# EAGLE design apex-alpha (EAGLE 5.11)
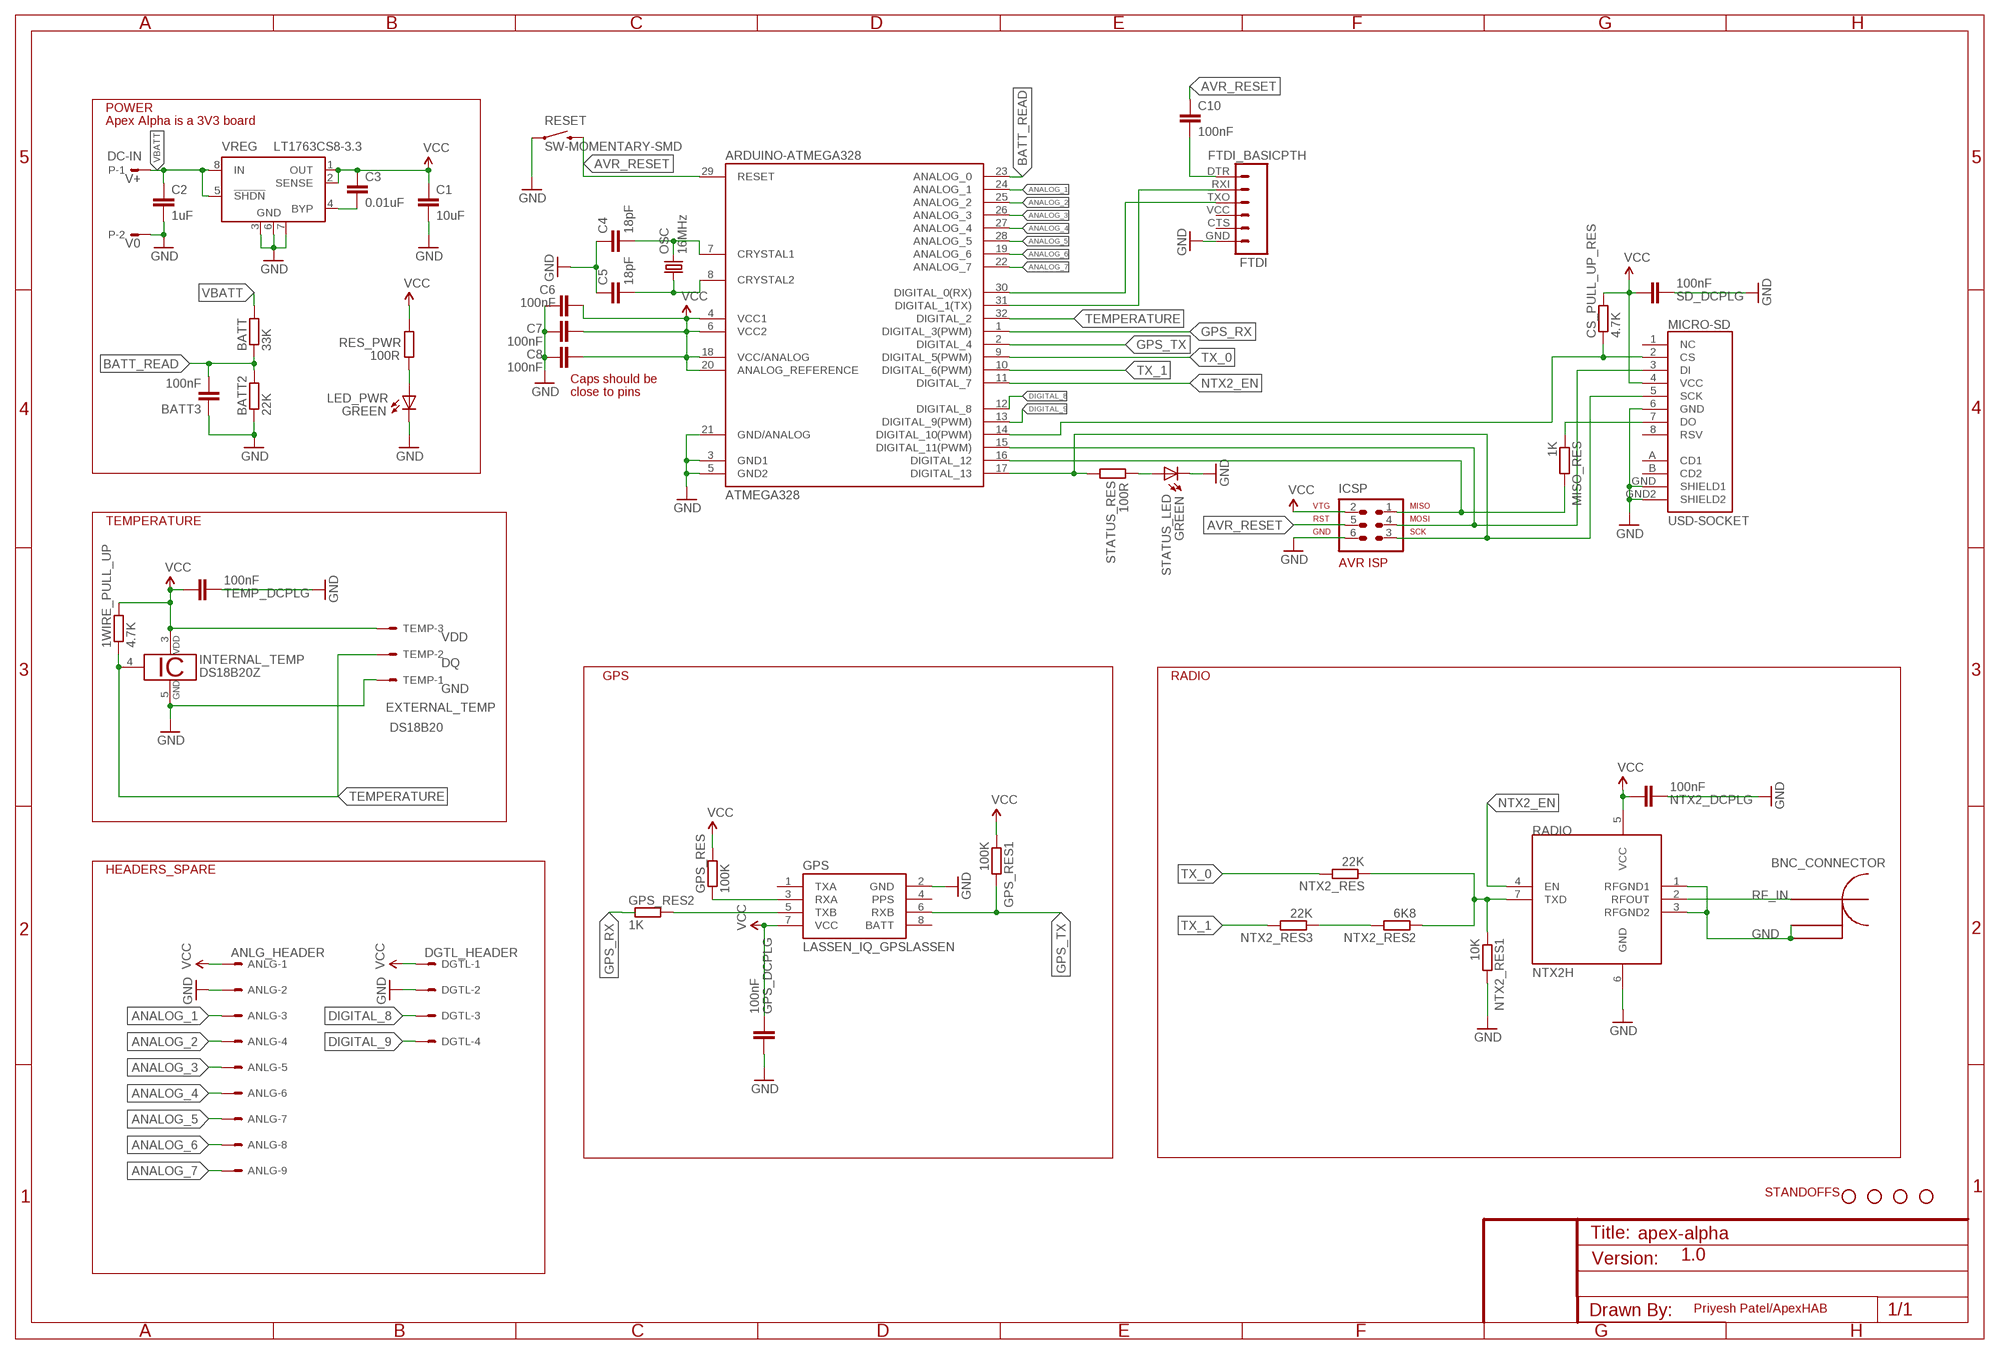
[diagram p0: schematic, sheet 1]

## Parts
1WIRE_PULL_UP  4.7K  R-EU_R0603  [R0603]
ANLG  ANLG_HEADER  22-27-2091-09  [6410-09]
ARDUINO-ATMEGA328  ATMEGA328  ATMEGA168-AU  [TQFP32-08]
BATT  33K  R-EU_R0603  [R0603]
BATT2  22K  R-EU_R0603  [R0603]
BATT3  100nF  CAP0805  [0805]
C1  10uF  CAP0805  [0805]
C2  1uF  CAP0805  [0805]
C3  0.01uF  CAP0805  [0805]
C4  18pF  CAP0805  [0805]
C5  18pF  CAP0805  [0805]
C6  100nF  CAP0805  [0805]
C7  100nF  CAP0805  [0805]
C8  100nF  CAP0805  [0805]
C10  100nF  CAP0805  [0805]
CS_PULL_UP_RES  4.7K  R-EU_R0603  [R0603]
DGTL  DGTL_HEADER  22-27-2041-04  [6410-04]
FTDI  FTDI_BASICPTH  [FTDI_BASIC]
GPS  LASSEN_IQ_GPSLASSEN  [LASSEN_IQ_GPS]
GPS_DCPLG  100nF  CAP0805  [0805]
GPS_RES  100K  R-EU_R0603  [R0603]
GPS_RES1  100K  R-EU_R0603  [R0603]
GPS_RES2  1K  R-EU_R0603  [R0603]
ICSP  AVR-ISP-6  [AVR-ISP-6]
INTERNAL_TEMP  DS18B20Z  [SO08]
JP1  STAND-OFF  [STAND-OFF]
JP2  STAND-OFF  [STAND-OFF]
JP3  STAND-OFF  [STAND-OFF]
JP4  STAND-OFF  [STAND-OFF]
LED_PWR  GREEN  LEDCHIPLED_0603  [CHIPLED_0603]
MICRO-SD  USD-SOCKET  [MICRO-SD-PUSH-PULL]
MISO_RES  1K  R-EU_R0603  [R0603]
NTX2_DCPLG  100nF  CAP0805  [0805]
NTX2_RES  22K  R-EU_R0603  [R0603]
NTX2_RES1  10K  R-EU_R0603  [R0603]
NTX2_RES2  6K8  R-EU_R0603  [R0603]
NTX2_RES3  22K  R-EU_R0603  [R0603]
OSC  16MHz  CRYSTAL5X3  [CRYSTAL-SMD-5X3]
P  DC-IN  22-27-2021-02  [6410-02]
RADIO  NTX2H  [NTX2H]
RES_PWR  100R  R-EU_R0603  [R0603]
RESET  SW-MOMENTARY-SMD  SWITCH-MOMENTARY-2-SMD-1101NE  [TACTILE-SWITCH-1101NE]
SD_DCPLG  100nF  CAP0805  [0805]
STATUS_LED  GREEN  LEDCHIPLED_0603  [CHIPLED_0603]
STATUS_RES  100R  R-EU_R0603  [R0603]
TEMP  EXTERNAL_TEMP  22-27-2031-03  [6410-03]
TEMP_DCPLG  100nF  CAP0805  [0805]
U$1  BNC_BULK  [BNC_BULK]
VREG  LT1763CS8-3.3  [SOIC8]

## Nets
ANALOG_1: ANLG.3 ARDUINO-ATMEGA328.24(ANALOG_1)
ANALOG_2: ANLG.4 ARDUINO-ATMEGA328.25(ANALOG_2)
ANALOG_3: ANLG.5 ARDUINO-ATMEGA328.26(ANALOG_3)
ANALOG_4: ANLG.6 ARDUINO-ATMEGA328.27(ANALOG_4)
ANALOG_5: ANLG.7 ARDUINO-ATMEGA328.28(ANALOG_5)
ANALOG_6: ANLG.8 ARDUINO-ATMEGA328.19(ANALOG_6)
ANALOG_7: ANLG.9 ARDUINO-ATMEGA328.22(ANALOG_7)
AVR_RESET: ARDUINO-ATMEGA328.29(RESET) C10.1 ICSP.5 RESET.P$2
BATT_READ: ARDUINO-ATMEGA328.23(ANALOG_0) BATT2.2 BATT3.2 BATT.1
DIGITAL_8: ARDUINO-ATMEGA328.12(DIGITAL_8) DGTL.3
DIGITAL_9: ARDUINO-ATMEGA328.13(DIGITAL_9(PWM)) DGTL.4
GND: ANLG.2 ARDUINO-ATMEGA328.3(GND1) ARDUINO-ATMEGA328.5(GND2) ARDUINO-ATMEGA328.21(GND/ANALOG) BATT2.1 BATT3.1 C1.2 C2.2 C4.1 C5.1 C6.1 C7.1 C8.1 DGTL.2 FTDI.GND GPS.2(GND) GPS_DCPLG.2 ICSP.6 INTERNAL_TEMP.5 LED_PWR.C MICRO-SD.6(GND) MICRO-SD.GND2(SHIELD2) MICRO-SD.GND(SHIELD1) NTX2_DCPLG.1 NTX2_RES1.2 P.2 RADIO.1(RFGND1) RADIO.3(RFGND2) RADIO.6(GND) RESET.P$1 SD_DCPLG.1 STATUS_LED.C TEMP.1 TEMP_DCPLG.1 U$1.G1(GND1) U$1.G2(GND) VREG.3(GND) VREG.6(GND) VREG.7(GND)
GPS_RX: ARDUINO-ATMEGA328.1(DIGITAL_3(PWM)) GPS_RES2.1
GPS_TX: ARDUINO-ATMEGA328.2(DIGITAL_4) GPS.6(RXB) GPS_RES1.2
MISO: ARDUINO-ATMEGA328.16(DIGITAL_12) ICSP.1 MISO_RES.2
MOSI: ARDUINO-ATMEGA328.15(DIGITAL_11(PWM)) ICSP.4 MICRO-SD.3(DI)
N$1: C3.2 VREG.4(BYP)
N$2: MICRO-SD.7(DO) MISO_RES.1
N$3: LED_PWR.A RES_PWR.1
N$4: C10.2 FTDI.DTR
N$5: ARDUINO-ATMEGA328.8(CRYSTAL2) C5.2 OSC.1
N$6: ARDUINO-ATMEGA328.7(CRYSTAL1) C4.2 OSC.3
N$7: NTX2_RES2.2 NTX2_RES3.1
N$8: STATUS_LED.A STATUS_RES.1
N$9: ARDUINO-ATMEGA328.31(DIGITAL_1(TX)) FTDI.RXI
N$10: ARDUINO-ATMEGA328.30(DIGITAL_0(RX)) FTDI.TXO
N$11: ARDUINO-ATMEGA328.14(DIGITAL_10(PWM)) CS_PULL_UP_RES.1 MICRO-SD.2(CS)
N$12: NTX2_RES1.1 NTX2_RES2.1 NTX2_RES.1 RADIO.7(TXD)
N$13: GPS.3(RXA) GPS_RES.1
N$14: GPS.5(TXB) GPS_RES2.2
NTX2_EN: ARDUINO-ATMEGA328.11(DIGITAL_7) RADIO.4(EN)
RF_IN: RADIO.2(RFOUT) U$1.RF
SCK: ARDUINO-ATMEGA328.17(DIGITAL_13) ICSP.3 MICRO-SD.5(SCK) STATUS_RES.2
TEMPERATURE: 1WIRE_PULL_UP.1 ARDUINO-ATMEGA328.32(DIGITAL_2) INTERNAL_TEMP.4 TEMP.2
TX_0: ARDUINO-ATMEGA328.9(DIGITAL_5(PWM)) NTX2_RES.2
TX_1: ARDUINO-ATMEGA328.10(DIGITAL_6(PWM)) NTX2_RES3.2
VBATT: BATT.2 C2.1 P.1 VREG.5(!SHDN) VREG.8(IN)
VCC: 1WIRE_PULL_UP.2 ANLG.1 ARDUINO-ATMEGA328.4(VCC1) ARDUINO-ATMEGA328.6(VCC2) ARDUINO-ATMEGA328.18(VCC/ANALOG) ARDUINO-ATMEGA328.20(ANALOG_REFERENCE) C1.1 C3.1 C6.2 C7.2 C8.2 CS_PULL_UP_RES.2 DGTL.1 GPS.7(VCC) GPS_DCPLG.1 GPS_RES1.1 GPS_RES.2 ICSP.2 INTERNAL_TEMP.3 MICRO-SD.4(VCC) NTX2_DCPLG.2 RADIO.5(VCC) RES_PWR.2 SD_DCPLG.2 TEMP.3 TEMP_DCPLG.2 VREG.1(OUT) VREG.2(SENSE)
Unconnected: FTDI.CTS FTDI.VCC GPS.1(TXA) GPS.4(PPS) MICRO-SD.1(NC) MICRO-SD.8(RSV) MICRO-SD.A(CD1) MICRO-SD.B(CD2)

## Notes on the sheet
- POWER
- Apex Alpha is a 3V3 board
- V+
- V0
- Caps should be
- close to pins
- TEMPERATURE
- VDD
- DQ
- GPS | RADIO
- GND
- DS18B20
- BNC_CONNECTOR
- HEADERS_SPARE
- STANDOFFS
- 1.0
- Priyesh Patel/ApexHAB

## Power pins joined to a net without a drawn wire
BATT: GPS.8(BATT)

## Library data of the parts
1WIRE_PULL_UP BATT BATT2 CS_PULL_UP_RES GPS_RES GPS_RES1 GPS_RES2 MISO_RES NTX2_RES NTX2_RES1-NTX2_RES3 RES_PWR STATUS_RES = rcl:R-EU_: RESISTOR, European symbol
ANLG = con-molex:22-?-09: CONNECTOR wire to board 2.54 mm (.1 inch) pitch header; OC_FARNELL: unknown; OC_NEWARK: unknown
ARDUINO-ATMEGA328 = Arduino-AVR:ATMEGA168
BATT3 C1-C8 C10 GPS_DCPLG NTX2_DCPLG SD_DCPLG TEMP_DCPLG = SparkFun:CAP: Capacitor Standard 0603 ceramic capacitor, and 0.1" leaded capacitor.
DGTL = con-molex:22-?-04: CONNECTOR wire to board 2.54 mm (.1 inch) pitch header; OC_FARNELL: unknown; OC_NEWARK: unknown
FTDI = SparkFun:FTDI_BASIC: FTDI Basic: 3.3V and 5V
GPS = SparkFun:LASSEN_IQ_GPS: Lassen iq 12-Channel GPS receiver. Schematic and footprint production proven. Spark Fun Electronics SKU : GPS-00163. Surface mount mating connector : GPS-00170
ICSP = avr-4:AVR-ISP-6: AVR ISP-6 Serial Programming Header
INTERNAL_TEMP = 1wire:DS18B20: Programmable Resolution Digital Thermometer This chip provides a onewire thermosensor with approx. 0.5°C accuracy. A programmable over/undertemperure alarm is available. The precision can be set from 9..12 bits. Notes: Vdd must be applied for accurate measurements at low temperatures, as the parasite power circuit otherwise heats the sensor. If parasite power is used, Vdd has to be connected to GND. The DS1822 is a low-cost thermometer chip, the DS18S20 is similar to the DS18B20, but with 9 Bit precision only. Author: Jan Kandziora <jjj@gmx.de>
JP1-JP4 = SparkFun:STAND-OFF: Stand Off This is the mechanical footprint for a #4 phillips button head screw. Use the keepout ring to avoid running the screw head into surrounding components. SKU : PRT-00447
LED_PWR STATUS_LED = led:LED: LED OSRAM: - CHIPLED LG R971, LG N971, LY N971, LG Q971, LY Q971, LO R971, LY R971 LH N974, LH R974 LS Q976, LO Q976, LY Q976 LO Q996 - Hyper CHIPLED LW Q18S LB Q993, LB Q99A, LB R99A - SideLED LS A670, LO A670, LY A670, LG A670, LP A670 LB A673, LV A673, LT A673, LW A673 LH A674 LY A675 LS A676, LA A676, LO A676, LY A676, LW A676 LS A679, LY A679, LG A679 - Hyper Micro SIDELED® LS Y876, LA Y876, LO Y876, LY Y876 LT Y87S - SmartLED LW L88C, LW L88S LB L89C, LB L89S, LG L890 LS L89K, LO L89K, LY L89K LS L896, LA L896, LO L896, LY L896 - TOPLED LS T670, LO T670, LY T670, LG T670, LP T670 LSG T670, LSP T670, LSY T670, LOP T670, LYG T670 LG T671, LOG T671, LSG T671 LB T673, LV T673, LT T673, LW T673 LH T674 LS T676, LA T676, LO T676, LY T676, LB T676, LH T676, LSB T676, LW T676 LB T67C, LV T67C, LT T67C, LS T67K, LO T67K, LY T67K, LW E67C LS E67B, LA E67B, LO E67B, LY E67B, LB E67C, LV E67C, LT E67C LW T67C LS T679, LY T679, LG T679 LS T770, LO T770, LY T770, LG T770, LP T770 LB T773, LV T773, LT T773, LW T773 LH T774 LS E675, LA E675, LY E675, LS T675 LS T776, LA T776, LO T776, LY T776, LB T776 LHGB T686 LT T68C, LB T68C - Hyper Mini TOPLED® LB M676 - Mini TOPLED Santana® LG M470 LS M47K, LO M47K, LY M47K Source: http://www.osram.convergy.de LUXEON: - LUMILED® LXK2-PW12-R00, LXK2-PW12-S00, LXK2-PW14-U00, LXK2-PW14-V00 LXK2-PM12-R00, LXK2-PM12-S00, LXK2-PM14-U00 LXK2-PE12-Q00, LXK2-PE12-R00, LXK2-PE12-S00, LXK2-PE14-T00, LXK2-PE14-U00 LXK2-PB12-K00, LXK2-PB12-L00, LXK2-PB12-M00, LXK2-PB14-N00, LXK2-PB14-P00, LXK2-PB14-Q00 LXK2-PR12-L00, LXK2-PR12-M00, LXK2-PR14-Q00, LXK2-PR14-R00 LXK2-PD12-Q00, LXK2-PD12-R00, LXK2-PD12-S00 LXK2-PH12-R00, LXK2-PH12-S00 LXK2-PL12-P00, LXK2-PL12-Q00, LXK2-PL12-R00 Source: www.luxeon.com KINGBRIGHT: KA-3528ASYC Source: www.kingbright.com
MICRO-SD = matt_brejza:USD-SOCKET: microSD Socket Push-push type uSD socket. Schematic element and footprint production proven. Spark Fun Electronics SKU : PRT-00127. tDoc lines correctly indicate media card edge positions when inserting (unlocked, locked, depressed).
OSC = SparkFun:CRYSTAL: Crystals Various standard crystals. Proven footprints. Spark Fun Electronics SKU : COM-00534
P = con-molex:22-?-02: CONNECTOR wire to board 2.54 mm (.1 inch) pitch header; OC_FARNELL: unknown; OC_NEWARK: unknown
RADIO = matt_brejza:NTX2
RESET = SparkFun:SWITCH-MOMENTARY-2
TEMP = con-molex:22-?-03: CONNECTOR wire to board 2.54 mm (.1 inch) pitch header; OC_FARNELL: unknown; OC_NEWARK: unknown
U$1 = matt_brejza:BNC_BULK
VREG = linear-technology:LT1763CS8: 500mA, Low Noise, LDO Micropower Regulators Source: http://cds.linear.com/docs/Datasheet/1763ff.pdf; MPN: LT1763CS8-3.3; OC_FARNELL: 1273617; OC_NEWARK: 57M6055

## Board
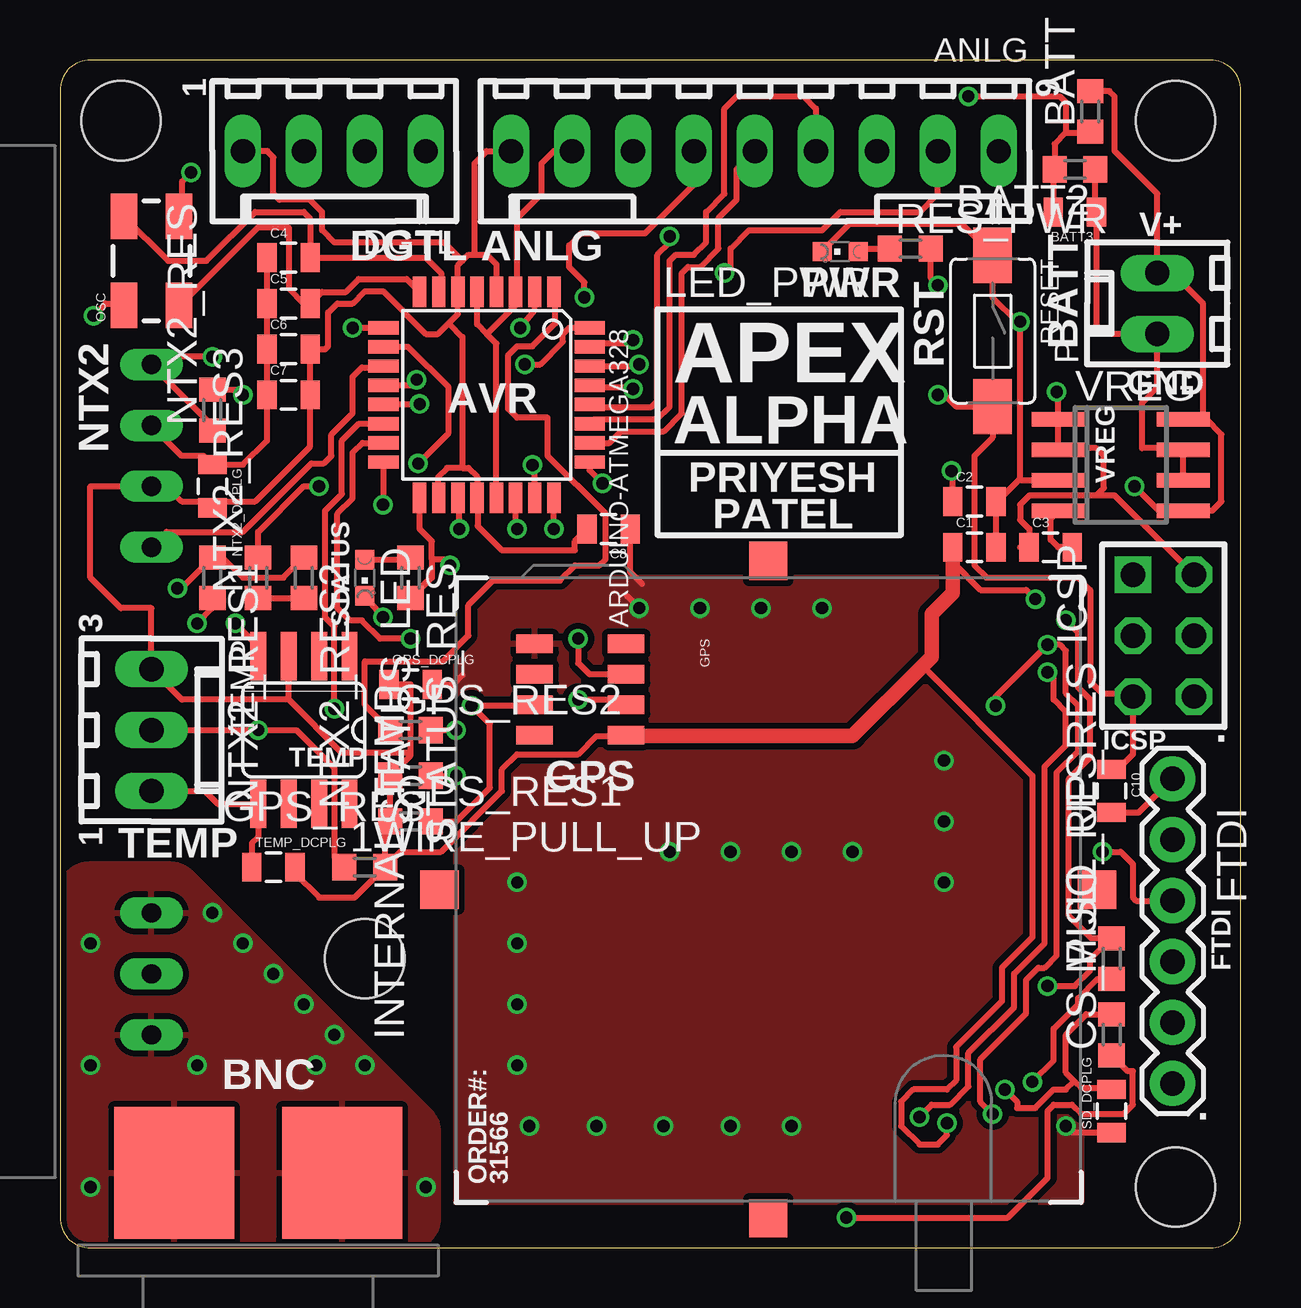
[diagram p1: board, top side]
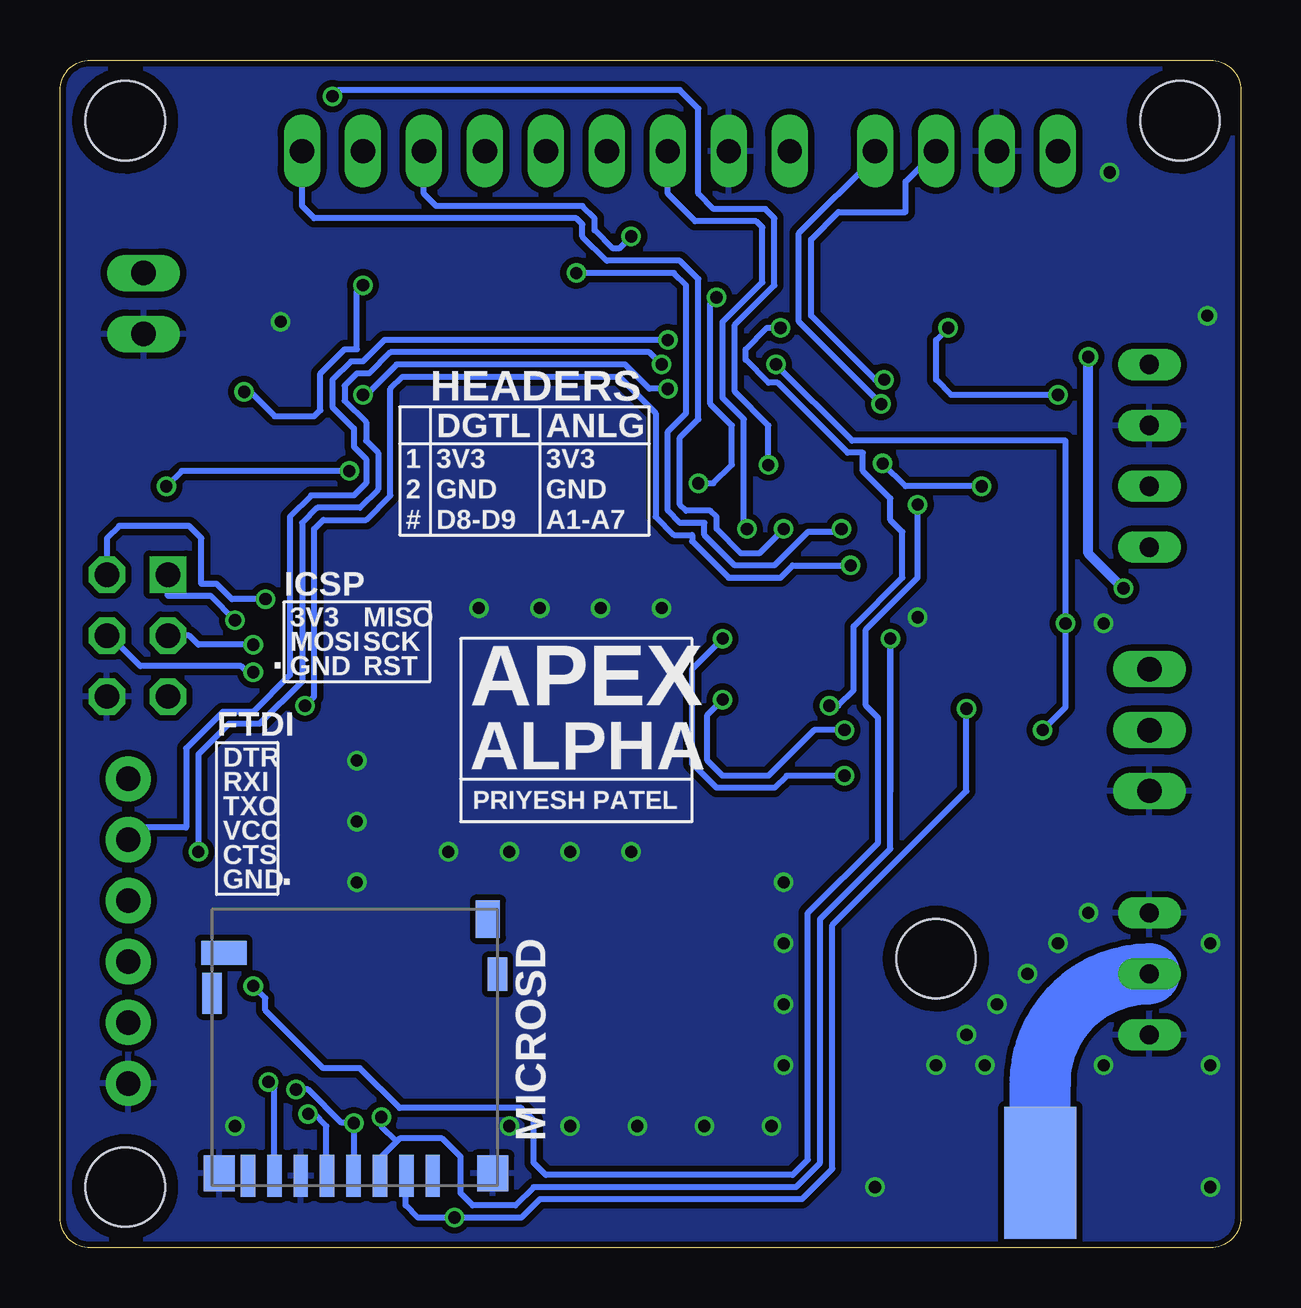
[diagram p2: board, bottom side, seen from below]

Size 49.2 x 49.52 mm. Coordinates in mm from the lower left corner, seen from the top.
Outline: 47.93,0 arc90 49.2,1.27 49.2,48.25 arc90 47.93,49.52 1.27,49.52 arc90 0,48.25 0,1.27 arc90 1.27,0 47.93,0
Copper layers (1*16): Top 0.035mm / dielectric 1.5mm / Bottom 0.035mm
Design rules "Fusion_eagle_rule_v1.1": minimum track width 6mil, minimum drill 12mil, track to track 6mil, track to pad 6mil, pad to pad 6mil, via to via 6mil, smd to smd 0mil, copper to edge 10mil, drill to drill 10mil, minimum pad ring 10mil, minimum via ring 6mil, stop-mask expansion 2mil, vias tented up to drill 100mil, thermal gap 10mil

### Footprints (pad centres in the part's own frame; a part is rotated, then mirrored left to right if it is on the bottom)
R0603 = smd 1 x 1.1: 1 -0.85,0; 2 0.85,0
6410-09 = drill 1.016 long: 1 10.16,0; 2 7.62,0; 3 5.08,0; 4 2.54,0; 5 0,0; 6 -2.54,0; 7 -5.08,0; 8 -7.62,0; 9 -10.16,0
TQFP32-08 = smd 1.27 x 0.559: 1 -4.293,2.8; 2 -4.293,2; 3 -4.293,1.2; 4 -4.293,0.4; 5 -4.293,-0.4; 6 -4.293,-1.2; 7 -4.293,-2; 8 -4.293,-2.8; 17 4.293,-2.8; 18 4.293,-2; 19 4.293,-1.2; 20 4.293,-0.4; 21 4.293,0.4; 22 4.293,1.2; 23 4.293,2; 24 4.293,2.8 | smd 0.559 x 1.27: 9 -2.8,-4.293; 10 -2,-4.293; 11 -1.2,-4.293; 12 -0.4,-4.293; 13 0.4,-4.293; 14 1.2,-4.293; 15 2,-4.293; 16 2.8,-4.293; 25 2.8,4.293; 26 2,4.293; 27 1.2,4.293; 28 0.4,4.293; 29 -0.4,4.293; 30 -1.2,4.293; 31 -2,4.293; 32 -2.8,4.293
0805 = smd 0.8 x 1.2: 1 -0.9,0; 2 0.9,0
6410-04 = drill 1.016 long: 1 3.81,0; 2 1.27,0; 3 -1.27,0; 4 -3.81,0
FTDI_BASIC = drill 1.016 pad 1.88 round: CTS 10.16,0; DTR 0,0; GND 12.7,0; RXI 2.54,0; TXO 5.08,0; VCC 7.62,0
LASSEN_IQ_GPS = smd 0.762 x 1.524: 1 2.752,7.076; 2 2.752,3.266; 3 4.022,7.076; 4 4.022,3.266; 5 5.292,7.076; 6 5.292,3.266; 7 6.562,7.076; 8 6.562,3.266 | smd 1.6 x 1.6: GND1 -0.7,13; GND2 13,26.7; GND3 26.7,13; GND4 13,-0.7
AVR-ISP-6 = drill 1.016 square: 1 -2.54,-1.27 | drill 1.016 octagon: 2 -2.54,1.27; 3 0,-1.27; 4 0,1.27; 5 2.54,-1.27; 6 2.54,1.27
SO08 = smd 0.66 x 2.032: 1 -1.905,-3.073; 2 -0.635,-3.073; 3 0.635,-3.073; 4 1.905,-3.073; 5 1.905,3.073; 6 0.635,3.073; 7 -0.635,3.073; 8 -1.905,3.073
STAND-OFF = hole 3.302: 0,0
CHIPLED_0603 = smd 0.8 x 0.8: A 0,-0.75; C 0,0.75
MICRO-SD-PUSH-PULL = smd 0.6 x 1.75: 1 5.7,-0.8; 2 4.6,-0.8; 3 3.5,-0.8; 4 2.4,-0.8; 5 1.3,-0.8; 6 0.2,-0.8; 7 -0.9,-0.8; 8 -2,-0.8 | smd 1 x 1.55: A 8,9.9 | smd 1.9 x 1: B -3,8.5 | smd 1.3 x 1.5: GND 8.2,-0.7; GND2 -3.2,-0.7 | smd 0.8 x 1.4: GND1 8.4,7.6 | smd 0.8 x 1.7: GND3 -3.5,6.8
CRYSTAL-SMD-5X3 = smd 1.9 x 1.1: 1 -1.85,-1.15; 2 1.85,-1.15; 3 1.85,1.15; 4 -1.85,1.15
6410-02 = drill 1.016 long: 1 1.27,0; 2 -1.27,0
NTX2H = drill 0.8 long: 1 -19.05,0; 2 -16.51,0; 3 -13.97,0; 4 1.27,0; 5 3.81,0; 6 6.35,0; 7 8.89,0
TACTILE-SWITCH-1101NE = smd 2.3 x 1.6: P$1 -3.15,0; P$2 3.15,0
6410-03 = drill 1.016 long: 1 2.54,0; 2 0,0; 3 -2.54,0
BNC_BULK = smd 5.5 x 5: G1 3,3.5; G2 3,-3.5 | smd 5.5 x 3 bottom: RF 3,-0.1
SOIC8 = smd 0.6 x 2.2: 1 -1.905,-2.6; 2 -0.635,-2.6; 3 0.635,-2.6; 4 1.905,-2.6; 5 1.905,2.6; 6 0.635,2.6; 7 -0.635,2.6; 8 -1.905,2.6

### Placement (x,y rotation side)
1WIRE_PULL_UP  12.7,15.88 0 top
ANLG  28.96,45.72 180 top
ARDUINO-ATMEGA328  17.78,35.56 270 top
BATT  42.93,47.37 90 top
BATT2  42.29,44.96 180 top
BATT3  42.29,43.18 180 top
C1  38.1,29.21 0 top
C2  38.1,31.11 0 top
C3  41.27,29.21 0 top
C4  9.53,41.27 0 top
C5  9.53,39.37 0 top
C6  9.53,37.47 0 top
C7  9.53,35.56 0 top
C8  22.86,29.97 180 top
C10  43.81,19.05 270 top
CS_PULL_UP_RES  43.81,8.89 90 top
DGTL  11.43,45.72 180 top
FTDI  46.35,19.56 270 top
GPS  16.51,27.94 270 top
GPS_DCPLG  14.61,23.5 0 top
GPS_RES  14.61,19.68 180 top
GPS_RES1  14.61,17.78 0 top
GPS_RES2  14.61,21.59 0 top
ICSP  45.97,25.53 270 top
INTERNAL_TEMP  10.16,21.59 180 top
JP1  2.54,46.99 0 top
JP2  46.48,46.99 0 top
JP3  12.7,12.06 0 top
JP4  46.48,2.54 0 top
LED_PWR  32.51,41.53 90 top
MICRO-SD  39.37,3.81 0 bottom
MISO_RES  43.81,12.06 90 top
NTX2_DCPLG  6.35,31.75 270 top
NTX2_RES  6.35,34.92 90 top
NTX2_RES1  6.35,27.94 270 top
NTX2_RES2  10.16,27.94 270 top
NTX2_RES3  8.26,27.94 90 top
OSC  3.81,41.15 90 top
P  45.72,39.37 90 top
RADIO  3.81,27.94 90 top
RES_PWR  35.43,41.66 0 top
RESET  38.86,38.23 270 top
SD_DCPLG  43.81,5.71 90 top
STATUS_LED  12.7,27.94 180 top
STATUS_RES  14.61,27.94 270 top
TEMP  3.81,21.59 270 top
TEMP_DCPLG  8.89,15.88 0 top
U$1  8.26,0.13 90 top
VREG  44.2,32.64 270 top

### Tracks (layer width: path | path; a pad name or v marks a point on that pad's centre or on a via)
ANALOG_1  (via drill 0.51)
  Top 0.254: v20.57,29.97 ARDUINO-ATMEGA328.24
  Bottom 0.254: v20.57,29.97 20.7,30.1 20.7,34.54 21.59,35.43 21.59,38.61 19.94,40.26 19.94,42.55 20.19,42.8 22.73,42.8 23.88,43.94 ANLG.3
ANALOG_2  (via drill 0.51)
  Top 0.254: v21.84,39.62 21.84,40.26 21.21,40.89 21.21,41.78 21.72,42.29 24.38,42.29 26.42,44.32 ANLG.4 | ARDUINO-ATMEGA328.25 22.07,32.41 v22.61,31.88
  Bottom 0.254: v21.84,39.62 22.1,39.37 22.1,35.18 21.21,34.29 21.21,32.64 21.97,31.88 v22.61,31.88
ANALOG_3
  Top 0.254: 22.11,33.53 ARDUINO-ATMEGA328.26 22.89,33.56 23.37,34.04 25.15,34.04 25.91,34.8 25.91,40.64 26.16,40.89 26.67,40.89 27.43,41.66 27.43,42.93 28.19,43.69 28.19,44.96 ANLG.5
ANALOG_4
  Top 0.254: 22.13,34.42 ARDUINO-ATMEGA328.27 22.26,34.54 24.89,34.54 25.4,35.05 25.4,41.15 25.65,41.4 26.42,41.4 26.92,41.91 26.92,43.18 27.69,43.94 27.69,47.5 28.19,48.01 30.99,48.01 31.5,47.5 ANLG.6
ANALOG_5  (via drill 0.51)
  Top 0.254: ARDUINO-ATMEGA328.28 22.18,35.05 24.64,35.05 24.89,35.31 24.89,41.4 25.4,41.91 v25.4,42.16
  Bottom 0.254: ANLG.7 34.04,43.94 33.53,43.43 27.43,43.43 26.92,42.93 26.92,42.42 26.16,41.66 25.91,41.66 v25.4,42.16
ANALOG_6  (via drill 0.51)
  Top 0.254: v16.64,29.97 16.64,31.21 ARDUINO-ATMEGA328.19 | v27.69,40.64 27.94,40.89 27.94,41.66 28.7,42.42 31.75,42.42 32.51,43.18 35.81,43.18 36.58,43.94 ANLG.8
  Bottom 0.254: v16.64,29.97 16.76,29.84 18.03,29.84 19.43,28.45 21.08,28.45 22.35,29.72 22.35,30.23 23.37,30.23 23.88,30.73 23.88,34.04 23.11,34.8 23.11,40.13 23.62,40.64 v27.69,40.64
ANALOG_7  (via drill 0.51)
  Top 0.254: ARDUINO-ATMEGA328.22 18.98,30.04 v19.05,29.97
  Bottom 0.254: v19.05,29.97 20.07,28.96 20.83,28.96 21.84,29.97 21.84,30.48 22.1,30.73 23.11,30.73 23.37,30.99 23.37,33.78 22.61,34.54 22.61,40.39 23.37,41.15 26.42,41.15 27.43,42.16 27.43,42.67 27.69,42.93 38.61,42.93 39.12,43.43 ANLG.9
AVR_RESET  (via drill 0.51)
  Top 0.254: ARDUINO-ATMEGA328.29 22.16,35.88 23.81,35.88 v23.88,35.81 | v36.58,35.56 36.85,35.56 37.34,35.08 RESET.P$2 38.86,33.78 38.1,33.02 38.1,28.45 38.61,27.94 42.42,27.94 42.93,27.43 42.93,23.62 43.43,23.11 44.58,23.11 ICSP.5 44.7,20.57 44.08,19.95 C10.1
  Bottom 0.254: v36.58,35.56 36.45,35.56 35.18,36.83 25.65,36.83 24.64,35.81 v23.88,35.81
BATT_READ  (via drill 0.51)
  Top 0.254: ARDUINO-ATMEGA328.23 19.78,32.54 v19.68,32.64 | BATT3.2 41.39,44.91 BATT2.2 41.44,46.01 41.91,46.48 | 41.91,46.48 42.89,46.48 BATT.1 | v37.85,48.01 41.66,48.01 41.91,47.75 41.91,46.48
  Bottom 0.254: v19.68,32.64 19.68,34.29 21.08,35.69 21.08,38.48 19.43,40.13 19.43,42.93 19.81,43.31 21.97,43.31 22.61,43.94 22.61,47.5 23.37,48.26 37.59,48.26 v37.85,48.01
DIGITAL_8  (via drill 0.51)
  Top 0.254: ARDUINO-ATMEGA328.12 14.62,35.96 v14.86,36.2
  Bottom 0.254: DGTL.3 13.97,44.45 13.97,43.18 16.76,43.18 17.91,42.04 17.91,38.86 15.24,36.2 v14.86,36.2
DIGITAL_9  (via drill 0.51)
  Top 0.254: ARDUINO-ATMEGA328.13 13.51,35.18 v14.99,35.18
  Bottom 0.254: DGTL.4 15.24,45.47 18.41,42.29 18.41,38.61 v14.99,35.18
GND  (via drill 0.51)
  Top 0.254: RADIO.6 5.08,33.02 5.98,33.02 NTX2_DCPLG.1 7.62,32.65 8.62,33.66 C7.1 C6.1 C5.1 C4.1 | ARDUINO-ATMEGA328.3 19.05,39.78 | ARDUINO-ATMEGA328.5 17.38,38.5 17.78,38.1 | ARDUINO-ATMEGA328.3 19.05,39.92 19.05,42.93 20.07,43.94 20.07,45.21 20.57,45.72 ANLG.2 | VREG.3 40.07,32 40.01,32.07 | 40.01,32.07 39.05,31.11 C2.2 C1.2 | VREG.6 VREG.7 46.73,33.34 45.09,33.34 45.09,35.24 45.72,35.88 P.2 43.43,38.1 43.19,38.34 BATT3.1 43.14,43.23 BATT2.1 | 42.17,4.82 SD_DCPLG.1 | TEMP_DCPLG.1 7.99,16.88 8.26,17.14 INTERNAL_TEMP.5 6.57,18.52 6.03,19.05 TEMP.1 | ARDUINO-ATMEGA328.21 18.18,37.7 17.78,38.1 | NTX2_RES1.2 6.35,26.67 v5.71,26.04 | STATUS_LED.C 12.7,27.18 v13.46,26.29 | 15.62,23.5 GPS_DCPLG.2 16.38,23.5 16.76,23.88 | LED_PWR.C 32.89,42.67 37.59,42.67 38.86,41.4 RESET.P$1 38.86,39.62 39.88,38.61 v40.01,38.61 40.01,32.07 | ARDUINO-ATMEGA328.3 18.98,39.3 17.78,38.1 | 2.54,39.37 1.91,39.37 v1.4,38.86 | 5.08,43.18 5.08,44.45 v5.46,44.83 | v24.13,26.67 23.63,27.17 | C8.1 23.76,28.18 24.26,27.69
  Bottom 0.254: v13.46,26.29 13.46,26.42
  other vias: 41.91,5.08 1.27,12.7 1.27,7.62 1.27,2.54 15.24,2.54 26.67,26.67 29.21,26.67 31.75,26.67 36.83,20.32 36.83,17.78 36.83,15.24 33.02,16.51 30.48,16.51 27.94,16.51 25.4,16.51 19.05,15.24 19.05,12.7 19.05,10.16 19.05,7.62 19.56,5.08 22.35,5.08 25.15,5.08 27.94,5.08 5.71,7.62 6.35,13.97 7.62,12.7 8.89,11.43 10.16,10.16 11.43,8.89 12.7,7.62 30.48,5.08 10.67,7.62
  pour Bottom (isolate 0.254): 0,0 0,49.53 49.53,49.53 49.53,0
  pour Top (isolate 0.254): 0,0 0,14.73 arc-90 1.27,16 4.55,16 arc-45 5.45,15.63 15.38,5.71 arc-45 15.75,4.81 15.75,1.27 arc-90 14.48,0
  pour Top (isolate 0.254): 16.51,27.94 41.91,27.94 42.55,27.94 42.55,1.91 16.51,1.91
GPS_RX
  Top 0.254: GPS_RES2.1 12.7,22.64 12.7,24.45 15.94,24.45 17.02,25.53 17.02,26.8 18.03,27.81 20.83,27.81 21.46,28.45 22.48,28.45 22.73,28.7 22.73,30.61 20.32,33.02 20.32,34.61 19.05,34.61 18.67,34.99 18.67,37.21 19.05,37.59 19.68,37.59 20.64,38.54 20.64,39.8 ARDUINO-ATMEGA328.1
GPS_TX  (via drill 0.51)
  Top 0.254: GPS.6 19.73,22.61 v17.14,22.61 17.91,21.84 17.91,19.18 16.51,17.78 GPS_RES1.2 | ARDUINO-ATMEGA328.2 19.78,39.08 v19.18,38.35
  Bottom 0.254: v17.14,22.61 16.76,22.61 16.13,23.24 16.13,25.91 14.1,27.94 14.1,29.84 14.61,30.35 14.61,31.24 15.75,32.38 15.75,33.15 16.38,33.15 19.3,36.07 19.68,36.07 20.64,37.02 20.64,37.47 19.75,38.35 v19.18,38.35
MISO  (via drill 0.51)
  Top 0.254: ARDUINO-ATMEGA328.16 13.49,31.01 v13.46,30.99 | v41.91,26.16 42.42,25.65 42.42,23.37 42.93,22.86 42.93,20.45 42.04,19.56 42.04,13.84 42.97,12.91 MISO_RES.2 42.93,12.03 42.93,11.56 42.29,10.92 v41.15,10.92
  Bottom 0.254: v13.46,30.99 13.46,27.94 15.62,25.78 15.62,22.61 15.11,22.1 15.11,16.89 18.03,13.97 18.03,3.68 18.67,3.05 28.96,3.05 29.46,3.56 29.46,5.33 29.97,5.84 35.05,5.84 36.7,7.49 38.23,7.49 40.64,9.91 40.64,10.41 v41.15,10.92 | v41.91,26.16 42.93,27.18 44.7,27.18 ICSP.1
MOSI  (via drill 0.51)
  Top 0.254: ARDUINO-ATMEGA328.15 12.61,33.56 12.19,33.15 12.19,31.24 11.56,30.61 11.56,26.67 12.06,26.16 12.57,26.16 13.34,25.4 v14.61,25.4 | v41.15,24 41.4,23.75 41.4,22.86 41.91,22.35 41.91,20.95 41.02,20.07 41.02,12.7 39.75,11.43 39.75,10.03 37.85,8.13 37.85,6.73 37.08,5.97 36.32,5.97 v35.81,5.46
  Bottom 0.254: 14.61,19.05 v14.61,25.4 14.61,16.64 17.53,13.72 17.53,3.56 18.54,2.54 29.46,2.54 30.23,1.78 32,1.78 32.51,2.29 32.51,3.81 33.27,4.57 35.05,4.57 35.18,4.45 | ICSP.4 47.12,25.53 45.85,24.26 41.66,24.26 41.4,24 v41.15,24 | 35.18,4.45 35.81,3.81 35.81,3.07 MICRO-SD.3 | v35.81,5.46 35.81,5.08 35.18,4.45
N$1
  Top 0.254: C3.2 41.59,29.21 41.27,29.53 41.27,30.41 VREG.4
N$2  (via drill 0.51)
  Top 0.254: MISO_RES.1 43.22,11.21 42.42,10.41 42.42,10.16 41.4,9.14 41.4,7.81 v40.51,6.92
  Bottom 0.254: MICRO-SD.7 40.27,6.68 v40.51,6.92
N$3
  Top 0.254: LED_PWR.A 33.39,41.66 RES_PWR.1
N$4
  Top 0.254: C10.2 44.95,18.15 FTDI.DTR
N$5
  Top 0.254: 5.03,39.37 OSC.1 5.41,39.75 5.46,39.75 8.26,42.55 9.53,42.55 9.53,40.01 10.16,39.37 C5.2 10.91,39.85 11.91,39.85 12.45,40.39 14.45,40.39 ARDUINO-ATMEGA328.8
N$6
  Top 0.254: ARDUINO-ATMEGA328.7 15.88,39.95 15.88,40.64 15.24,41.27 C4.2 10.43,42.91 10.16,43.18 8.13,43.18 6.1,41.15 4.51,41.15 OSC.3
N$7
  Top 0.254: NTX2_RES3.1 NTX2_RES2.2
N$8
  Top 0.254: STATUS_LED.A 14.51,28.69 STATUS_RES.1
N$9  (via drill 0.51)
  Top 0.254: 22.17,37.47 ARDUINO-ATMEGA328.31 22.23,37.72 23.75,37.72 v23.88,37.85
  Bottom 0.254: v23.88,37.85 35.69,37.85 36.58,36.96 37.08,36.96 37.85,36.2 37.85,35.05 36.96,34.16 36.96,33.4 36.45,32.89 36.45,31.88 36.96,31.37 38.73,31.37 39.62,30.48 39.62,23.88 41.15,22.35 42.42,22.35 43.94,20.83 43.94,17.53 45.85,17.53 FTDI.RXI
N$10  (via drill 0.51)
  Top 0.254: ARDUINO-ATMEGA328.30 24.06,36.76 v24.13,36.83 | v43.43,16.51 44.2,16.51 44.7,16 44.7,14.61 44.83,14.48 FTDI.TXO
  Bottom 0.254: v24.13,36.83 24.64,37.34 35.43,37.34 36.32,36.45 36.83,36.45 37.34,35.94 37.34,35.31 36.45,34.42 36.45,33.66 35.94,33.15 35.94,31.62 36.7,30.86 38.48,30.86 39.12,30.23 39.12,23.62 40.89,21.84 42.16,21.84 43.43,20.57 v43.43,16.51
N$11  (via drill 0.51)
  Top 0.254: ARDUINO-ATMEGA328.14 12.45,34.36 11.75,33.66 11.75,31.43 11.05,30.73 11.05,26.29 11.43,25.91 v11.43,22.48 | CS_PULL_UP_RES.1 44.49,7.37 44.7,7.37 44.7,5.97 44.32,5.59 42.55,5.59 42.16,5.97 41.4,5.97 41.15,5.71 41.15,2.92 39.5,1.27 v32.77,1.27
  Bottom 0.254: 34.6,3.17 MICRO-SD.2 34.8,2.98 34.8,1.78 34.29,1.27 v32.77,1.27 29.97,1.27 29.21,2.03 18.29,2.03 17.02,3.3 17.02,13.46 11.43,19.05 v11.43,22.48
N$12  (via drill 0.51)
  Top 0.254: NTX2_RES2.1 9.31,27.94 7.62,27.94 6.77,28.79 NTX2_RES1.1 5.06,27.5 v4.89,27.5 | NTX2_RES.1 6.35,34.29 RADIO.7 4.13,37.15 v6.35,37.15
  Bottom 0.406: v6.35,37.15 6.35,28.96 v4.89,27.5
N$13  (via drill 0.51)
  Top 0.254: GPS.3 23.37,24.13 | GPS_RES.1 v16.51,19.68 | 24.13,24.13 23.8,24.13 GPS.3 | GPS.3 22.06,23.92 21.59,24.38 v21.59,25.4
  Bottom 0.254: v16.51,19.68 18.92,19.68 19.43,19.18 21.84,19.18 22.86,20.19 22.86,24.13 v21.59,25.4
N$14  (via drill 0.51)
  Top 0.254: GPS_RES2.2 v16.51,21.59 | v21.59,22.86 23.37,22.86 GPS.5
  Bottom 0.254: v16.51,21.59 17.78,21.59 19.68,19.68 21.59,19.68 22.23,20.32 22.23,22.23 v21.59,22.86
NTX2_EN
  Top 0.254: RADIO.4 4.45,29.84 7.62,29.84 10.48,32.7 10.99,32.7 11.3,33.02 11.3,33.91 12.19,34.8 12.19,36.32 12.57,36.7 13.43,36.7 ARDUINO-ATMEGA328.11
RF_IN
  Bottom 2.54: RADIO.2 arc-90 8.36,6.88 U$1.RF
SCK  (via drill 0.51)
  Top 0.254: ARDUINO-ATMEGA328.17 14.98,29.98 15.49,29.46 15.49,28.7 | 15.49,28.7 15.49,27.98 | 15.49,27.98 STATUS_RES.2 14.64,27.09 15.49,27.94 15.49,27.98 | 15.49,28.7 16,28.7 v16.26,28.45 | v38.86,5.59 38.35,6.1 38.35,7.87 40.26,9.78 40.26,11.18 40.77,11.68 41.02,11.68 41.53,12.19 41.53,19.81 42.42,20.7 42.42,22.61 41.91,23.11 41.91,24.89 41.66,25.15 v41.15,25.15 38.99,22.99 v38.99,22.61
  Bottom 0.254: v16.26,28.45 18.67,28.45 19.18,27.94 21.34,27.94 22.86,29.46 22.86,29.72 23.62,29.72 24.38,30.48 24.38,34.8 25.91,36.32 34.92,36.32 35.43,35.81 35.43,31.37 36.45,30.35 38.23,30.35 38.61,29.97 38.61,22.99 v38.99,22.61 | MICRO-SD.5 38.1,3.04 38.1,5.08 38.61,5.59 v38.86,5.59 | v41.15,25.15 43.43,25.15 43.81,25.53 ICSP.3
TEMPERATURE  (via drill 0.51)
  Top 0.254: TEMP.2 v8.26,21.59 9.84,21.59 11.43,20 11.43,16.3 1WIRE_PULL_UP.1 | v7.3,26.04 8.26,25.08 INTERNAL_TEMP.4 | 22.02,38.42 ARDUINO-ATMEGA328.32 21.21,38.35 20.95,38.1 20.95,37.78 20,36.83 v19.37,36.83
  Bottom 0.254: v8.26,21.59 7.3,22.54 v7.3,26.04 7.3,33.66 16.19,33.66 v19.37,36.83
TX_0  (via drill 0.51)
  Top 0.254: NTX2_RES.2 7.41,35.77 v7.62,35.56 | v12.19,38.35 ARDUINO-ATMEGA328.9
  Bottom 0.254: v7.62,35.56 12.06,35.56 12.7,36.2 12.7,37.85 v12.19,38.35
TX_1  (via drill 0.51)
  Top 0.254: ARDUINO-ATMEGA328.10 14.51,37.56 16.19,35.88 16.19,33.97 v14.92,32.7 | NTX2_RES3.2 8.26,29.84 10.16,31.75 v10.79,31.75
  Bottom 0.254: v10.79,31.75 13.97,31.75 v14.92,32.7
VBATT  (via drill 0.51)
  Top 0.254: VREG.5 46.86,30.8 | C2.1 37.2,32.33 v37.15,32.38 | v44.77,31.75 45.78,30.73 VREG.5 | VREG.5 48.01,30.73 48.39,31.11 48.39,33.91 47.75,34.54 VREG.8 46.86,34.61 47.62,34.61 47.62,39.37 46.35,40.64 P.1 45.72,43.94 43.94,45.72 43.94,48.01 43.73,48.22 BATT.2
  Bottom 0.254: v37.15,32.38 44.13,32.38 v44.77,31.75
VCC  (via drill 0.51)
  Top 0.254: 6.08,31.11 5.08,31.11 4.45,31.75 RADIO.5 1.27,31.75 1.27,27.94 2.54,26.67 3.81,26.67 TEMP.3 5.08,22.86 9.53,22.86 | 6.08,31.11 NTX2_DCPLG.2 | ARDUINO-ATMEGA328.6 16.51,39.92 | 14.61,20.54 GPS_RES.2 GPS_RES1.1 13.55,17.57 1WIRE_PULL_UP.2 | 14.61,20.54 14.61,23.5 GPS_DCPLG.1 | 40.01,29.21 C3.1 40.39,29.97 40.01,30.35 40.01,30.99 40.39,31.37 43.18,31.37 | CS_PULL_UP_RES.2 42.76,9.74 41.91,8.89 41.91,7.3 42.26,6.95 | 42.26,6.95 42.55,6.67 43.76,6.67 SD_DCPLG.2 | TEMP_DCPLG.2 9.79,15.61 10.79,14.61 12.28,14.61 1WIRE_PULL_UP.2 | 9.53,22.86 INTERNAL_TEMP.3 | 14.61,20.54 14.5,20.64 11.75,20.64 9.53,22.86 | 1WIRE_PULL_UP.2 14.19,16.51 15.88,16.51 18.41,19.05 18.41,19.94 19.05,20.57 21.59,20.57 22.35,21.34 23.54,21.34 GPS.7 23.48,21.27 | ARDUINO-ATMEGA328.20 17.46,31.35 | RES_PWR.2 36.28,40.42 v36.58,40.13 | v41.53,35.69 41.6,35.62 VREG.1 VREG.2 41.66,33.34 43.18,33.34 43.5,33.02 43.5,31.69 43.18,31.37 | C1.1 37.2,28.59 38.35,27.43 40.26,27.43 v40.64,27.05 | 43.18,31.37 43.94,31.37 ICSP.2 | 35.94,24.26 40.51,19.68 40.51,12.95 39.24,11.68 39.24,10.29 37.34,8.38 37.34,6.99 36.96,6.6 35.56,6.6 35.05,6.1 35.05,5.08 35.81,4.32 36.58,4.32 36.96,4.7 v36.96,5.21 | 41.91,6.6 42.26,6.95 | 41.91,6.6 | 41.91,6.6 41.4,6.6 40.64,5.84 39.88,5.84 39.88,6.1 v39.37,6.6 | 16.19,38.54 15.75,38.1 15.24,38.1 13.46,39.88 12.7,39.88 12.19,39.37 11.56,39.37 11.18,38.99 11.18,37.59 11.05,37.47 C6.2 C7.2 10.43,33.41 8.13,31.11 6.08,31.11 | 16.19,38.54 16.58,38.93 ARDUINO-ATMEGA328.6 | ARDUINO-ATMEGA328.4 18.18,41 17.78,41.4 17.27,41.4 | ARDUINO-ATMEGA328.6 16.58,40.96 16.76,41.15 | 16.76,41.15 17.02,41.4 17.27,41.4
  Top 0.254: DGTL.1 8.64,45.72 8.89,45.47 8.89,43.94 9.14,43.69 10.41,43.69 10.92,43.18 10.92,42.42 11.43,41.91 16,41.91 16.76,41.15 | ARDUINO-ATMEGA328.20 17.38,32.15 17.02,32.51 16.76,32.51 | ARDUINO-ATMEGA328.18 15.75,31.3 15.75,32.13 16.13,32.51 16.76,32.51 | 16.76,32.51 16.76,37.97 16.19,38.54 | ANLG.1 17.78,45.72 17.27,45.21 17.27,41.4 | ARDUINO-ATMEGA328.20 17.4,31.25 17.4,30.1 18.41,29.08 21.45,29.08 21.45,29.46 C8.2
  Top 0.61: 37.2,28.59 37.2,27.29 36.32,26.42 36.32,24.64 35.94,24.26 33.02,21.34 23.63,21.34 GPS.7
  Bottom 0.254: v36.58,40.13 36.83,39.88 36.83,37.47 37.34,37.47 38.35,36.45 38.35,34.92 38.61,34.67 40.26,34.67 41.27,35.69 v41.53,35.69 | v40.64,27.05 42.04,27.05 42.67,27.69 43.31,27.69 43.31,29.59 43.81,30.1 46.74,30.1 47.24,29.59 ICSP.2 | v39.37,6.6 38.86,6.6 37.48,5.22 v36.97,5.22 v36.96,5.21 36.97,5.19 MICRO-SD.4

### Text on the board
tPlace: 1 | 9 | V+ | DGTL | ANLG | PWR | RST | BATT | APEX | GND | AVR | ALPHA | NTX2 | VREG | PRIYESH | PATEL | 3 | STATUS | ICSP | . | TEMP | GPS | 1 | TEMP | FTDI | BNC | . | ORDER#: | 31566
bPlace: HEADERS | ANLG | DGTL | 3V3 | 3V3 | 1 | GND | GND | 2 | A1-A7 | D8-D9 | # | ICSP | MISO | 3V3 | SCK | MOSI | RST | GND | . | APEX | FTDI | ALPHA | DTR | RXI | PRIYESH PATEL | TXO | VCC | CTS | . | GND | MICROSD